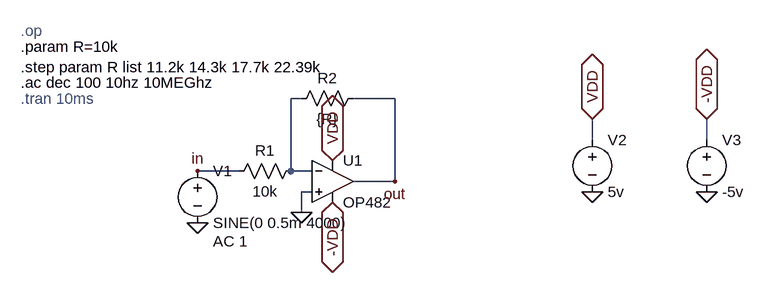
[diagram p0: schematic Draft3.asc]
Draft3.asc, the LTspice schematic file:
Version 4.1
SHEET 1 880 680
WIRE 160 32 144 32
WIRE 304 32 240 32
WIRE 608 96 608 64
WIRE 784 96 784 64
WIRE 64 144 0 144
WIRE 144 144 144 32
WIRE 176 144 144 144
WIRE 304 160 304 32
WIRE 304 160 240 160
WIRE 176 176 160 176
WIRE 160 208 160 176
FLAG 160 208 0
FLAG 0 224 0
FLAG 304 160 out
FLAG 0 144 in
FLAG 608 176 0
FLAG 784 176 0
FLAG 608 64 VDD
IOPIN 608 64 BiDir
FLAG 208 128 VDD
IOPIN 208 128 BiDir
FLAG 784 64 -VDD
IOPIN 784 64 BiDir
FLAG 208 192 -VDD
IOPIN 208 192 BiDir
SYMBOL OpAmps\\OP482 208 96 R0
SYMATTR InstName U1
SYMBOL res 160 128 R90
WINDOW 0 0 56 VBottom 2
WINDOW 3 32 56 VTop 2
SYMATTR InstName R1
SYMATTR Value 10k
SYMBOL res 256 16 R90
WINDOW 0 0 56 VBottom 2
WINDOW 3 32 56 VTop 2
SYMATTR InstName R2
SYMATTR Value {R}
SYMBOL voltage 0 128 R0
WINDOW 123 24 124 Left 2
WINDOW 39 0 0 Left 0
SYMATTR Value2 AC 1
SYMATTR InstName V1
SYMATTR Value SINE(0 0.5m 4000)
SYMBOL voltage 608 80 R0
SYMATTR InstName V2
SYMATTR Value 5v
SYMBOL voltage 784 80 R0
SYMATTR InstName V3
SYMATTR Value -5v
TEXT -272 -48 Left 2 !.param R=10k
TEXT -272 -16 Left 2 !.step param R list 11.2k 14.3k 17.7k 22.39k
TEXT -272 8 Left 2 !.ac dec 100 10hz 10MEGhz
TEXT -272 -72 Left 2 ;.op
TEXT -272 32 Left 2 ;.tran 10ms

The netlist it stands for:
* Draft3.asc
X§U1 0 N001 VDD -VDD out OP482  ; pins In+ In- V+ V- OUT
R1 N001 in 10k
R2 out N001 {R}
V1 in 0 SINE(0 0.5m 4000) AC 1
V2 VDD 0 5v
V3 -VDD 0 -5v
.param R=10k
.step param R list 11.2k 14.3k 17.7k 22.39k
.ac dec 100 10hz 10MEGhz
* .op
* .tran 10ms
.backanno
.end